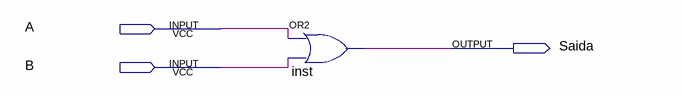
[diagram p0: schematic sheet]
// Quartus schematic Aula02_Or.bdf as structural Verilog: 1 symbols, 3 pins
module Aula02_Or (
  input  A,
  input  B,
  output Saida
);

  or inst (Saida, A, B);
endmodule
